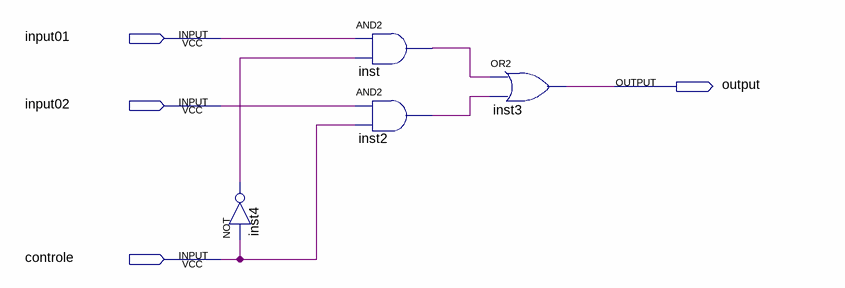
[diagram p0: schematic sheet]
// Quartus schematic multiplexador21.bdf as structural Verilog: 4 symbols, 4 pins
module multiplexador21 (
  input  input01,
  input  input02,
  input  controle,
  output \output 
);

  wire inst2_out, inst4_out, inst_out;

  not inst4 (inst4_out, controle);
  and inst (inst_out, input01, inst4_out);
  and inst2 (inst2_out, input02, controle);
  or inst3 (\output , inst_out, inst2_out);
endmodule
